# EAGLE design Audio_player_1_0 (EAGLE 6.6.0)
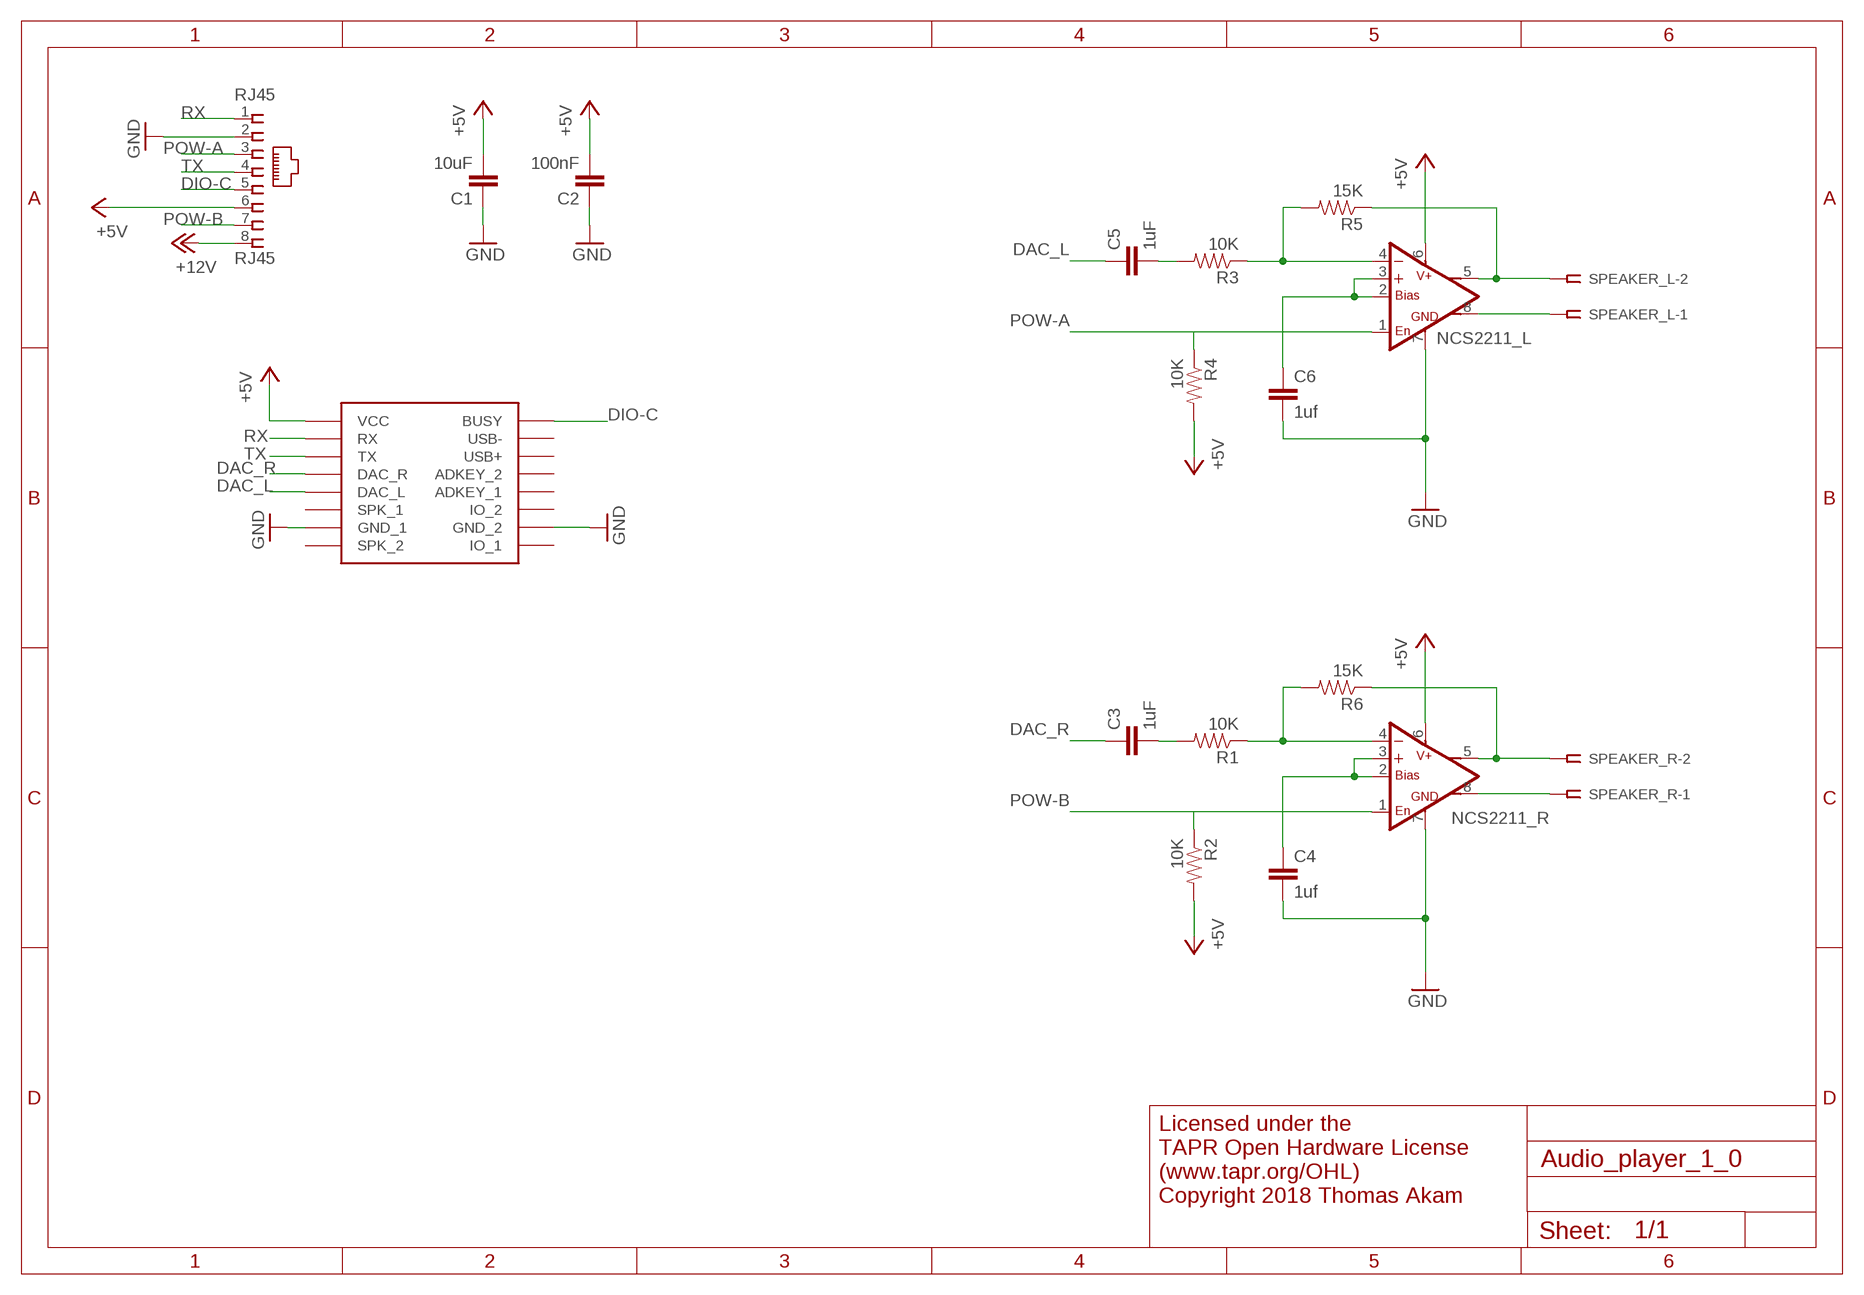
[diagram p0: schematic, sheet 1]

## Parts
C1  10uF  C-EUC0805  [C0805]
C2  100nF  C-EUC0805  [C0805]
C3  1uF  C-EUC0805  [C0805]
C4  1uf  C-EUC0805  [C0805]
C5  1uF  C-EUC0805  [C0805]
C6  1uf  C-EUC0805  [C0805]
NCS2211_L  NCS22111M  [SO08]
NCS2211_R  NCS22111M  [SO08]
R1  10K  0.3OHM-1/8W-1%(0805)  [0805]
R2  10K  0.3OHM-1/8W-1%(0805)  [0805]
R3  10K  0.3OHM-1/8W-1%(0805)  [0805]
R4  10K  0.3OHM-1/8W-1%(0805)  [0805]
R5  15K  0.3OHM-1/8W-1%(0805)  [0805]
R6  15K  0.3OHM-1/8W-1%(0805)  [0805]
RJ45  RJ45  RJ45VERTICAL  [RJ45-NO-SHIELD-VERTICAL]
SPEAKER_L  SSW-102-02-S-S-RA  [SSW-102-02-S-S-RA]
SPEAKER_R  SSW-102-02-S-S-RA  [SSW-102-02-S-S-RA]
U$1  DFPLAYER  [DFPLAYER]

## Nets
+5V: C1.2 C2.2 NCS2211_L.6(VS) NCS2211_R.6(VS) R2.2 R4.2 RJ45.6 U$1.VCC
+12V: RJ45.8
AMP_REF: C4.1 NCS2211_R.2(BIAS) NCS2211_R.3(+IN)
AMP_REF1: C6.1 NCS2211_L.2(BIAS) NCS2211_L.3(+IN)
DAC_L: C5.1 U$1.DAC_L
DAC_R: C3.1 U$1.DAC_R
DIO-C: RJ45.5 U$1.BUSY
GND: C1.1 C2.1 C4.2 C6.2 NCS2211_L.7(GND) NCS2211_R.7(GND) RJ45.2 U$1.GND_1 U$1.GND_2
N$1: NCS2211_L.8(-OUT) SPEAKER_L.1
N$2: NCS2211_R.8(-OUT) SPEAKER_R.1
N$3: C3.2 R1.2
N$4: C5.2 R3.2
POW-A: NCS2211_L.1(ENABLE) R4.1 RJ45.3
POW-B: NCS2211_R.1(ENABLE) R2.1 RJ45.7
RX: RJ45.1 U$1.RX
SIG1: NCS2211_L.4(-IN) R3.1 R5.2
SIG3: NCS2211_R.4(-IN) R1.1 R6.2
SPEAKER+: NCS2211_R.5(+OUT) R6.1 SPEAKER_R.2
SPEAKER+1: NCS2211_L.5(+OUT) R5.1 SPEAKER_L.2
TX: RJ45.4 U$1.TX
Unconnected: U$1.ADKEY1(ADKEY_1) U$1.ADKEY2(ADKEY_2) U$1.IO1(IO_1) U$1.IO2(IO_2) U$1.SPK1(SPK_1) U$1.SPK2(SPK_2) U$1.USB+ U$1.USB-

## Notes on the sheet
- Licensed under the
  TAPR Open Hardware License
  (www.tapr.org/OHL)
  Copyright 2018 Thomas Akam

## Library data of the parts
C1-C6 = rcl:C-EU: CAPACITOR, European symbol
NCS2211_L NCS2211_R = NCS2211:NCS2211: Low Voltage Audio Power Amplifier Source: http://cache.national.com/ds/LM/LM386.pdf
R1-R6 = SparkFun-Resistors:0.3OHM-1/8W-1%(0805): RES-11622; PROD_ID: RES-11622; VALUE: 0.3
RJ45 = con-tycoelectronics-vertical_RJ45:RJ45: CORCOM Modular RJ Jacks No Shield Source: www.tycoelectronics.com .. ENG_DS_1654001_1099_RJ_L_0507.pdf
SPEAKER_L SPEAKER_R = con-samtec:SSW-102-02-S-S: THROUGH-HOLE .025" SQ POST SOCKET Source: Samtec SSW.pdf; MPN: SSW-102-02-S-S-RA; OC_FARNELL: unknown; OC_NEWARK: 11P9352
U$1 = DFPlayer_v1:DFPLAYER

## Net classes
1 power: width 0.508 mm

## Board
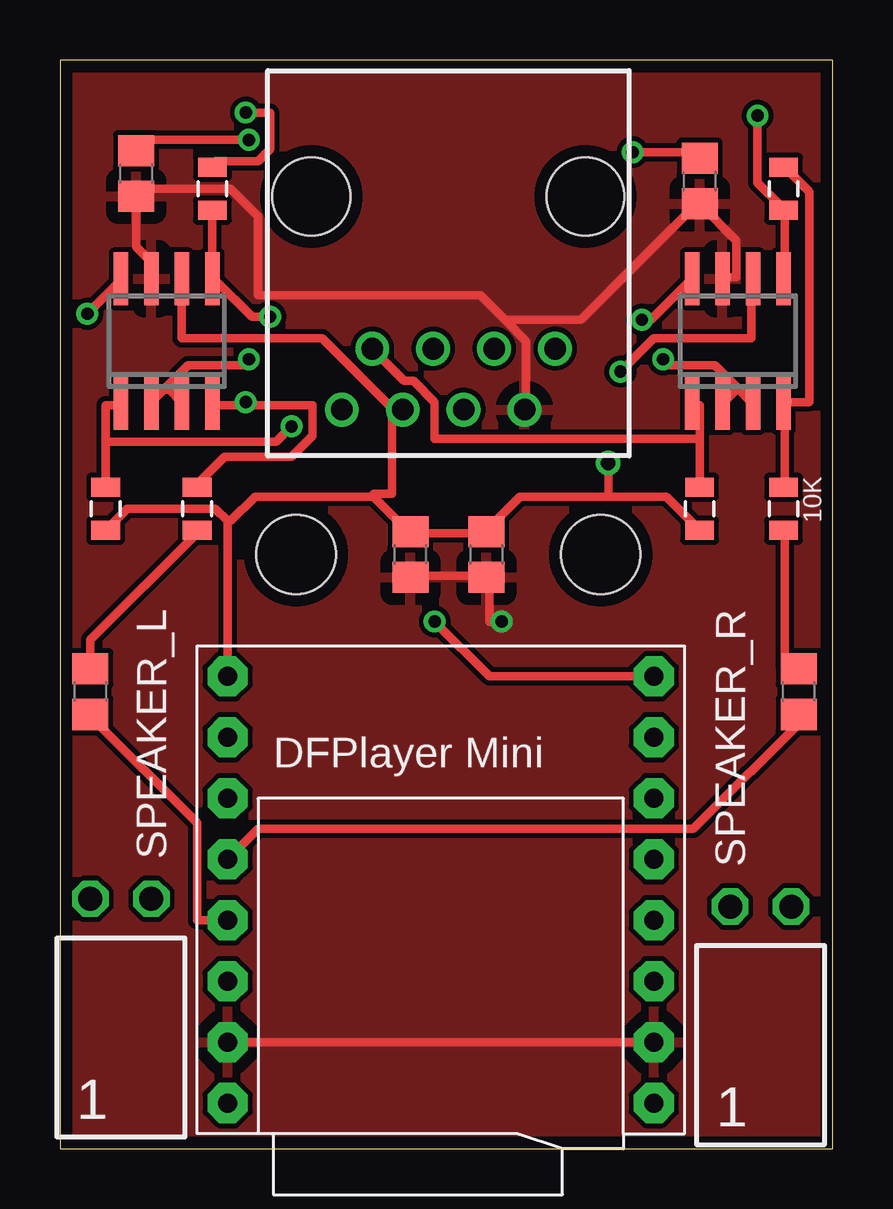
[diagram p1: board, top side]
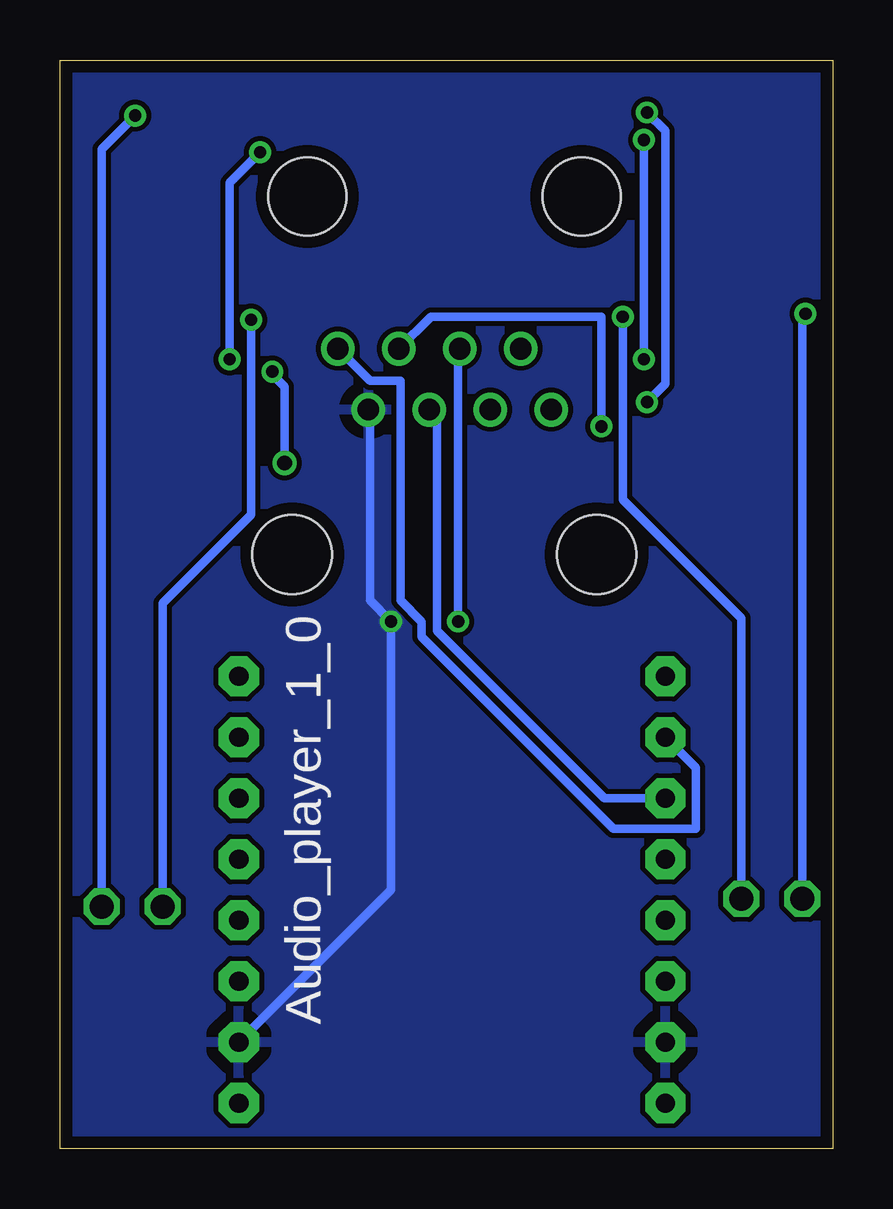
[diagram p2: board, bottom side, seen from below]

Size 32.22 x 45.37 mm. Coordinates in mm from the lower left corner, seen from the top.
Outline: 0,0 32.22,0 32.22,45.37 0,45.37 0,0
Copper layers (1*16): Top 0.035mm / dielectric 1.5mm / Bottom 0.035mm
Design rules "default *": minimum track width 14mil, minimum drill 20mil, track to track 8mil, track to pad 8mil, pad to pad 8mil, via to via 8mil, smd to smd 8mil, copper to edge 20mil, drill to drill 8mil, minimum pad ring 10mil, minimum via ring 8mil, stop-mask expansion 4mil, vias tented up to drill 0mil, thermal gap 20mil
Holes 3.3 mm at 22.54,24.77 9.84,24.77

### Footprints (pad centres in the part's own frame; a part is rotated, then mirrored left to right if it is on the bottom)
C0805 = smd 1.3 x 1.5: 1 -0.95,0; 2 0.95,0
SO08 = smd 0.6 x 2.2: 1 -1.905,-2.6; 2 -0.635,-2.6; 3 0.635,-2.6; 4 1.905,-2.6; 5 1.905,2.6; 6 0.635,2.6; 7 -0.635,2.6; 8 -1.905,2.6
0805 = smd 0.8 x 1.2: 1 -0.9,0; 2 0.9,0
RJ45-NO-SHIELD-VERTICAL = drill 0.9 pad 1.4: 1 -4.445,5.08; 2 -3.175,7.62; 3 -1.905,5.08; 4 -0.635,7.62; 5 0.635,5.08; 6 1.905,7.62; 7 3.175,5.08; 8 4.445,7.62 | hole 3.251: -5.715,-1.27; 5.715,-1.27
SSW-102-02-S-S-RA = drill 1 pad 1.5 octagon: 1 -1.27,1.524; 2 1.27,1.524
DFPLAYER = drill 0.8 pad 1.676 octagon: ADKEY1 8.89,-1.27; ADKEY2 8.89,1.27; BUSY 8.89,8.89; DAC_L -8.89,-1.27; DAC_R -8.89,1.27; GND_1 -8.89,-6.35; GND_2 8.89,-6.35; IO1 8.89,-8.89; IO2 8.89,-3.81; RX -8.89,6.35; SPK1 -8.89,-3.81; SPK2 -8.89,-8.89; TX -8.89,3.81; USB+ 8.89,3.81; USB- 8.89,6.35; VCC -8.89,8.89

### Placement (x,y rotation side)
C1  14.61,24.77 90 top
C2  17.78,24.77 90 top
C3  30.8,19.05 90 top
C4  26.67,40.32 270 top
C5  1.27,19.05 90 top
C6  3.17,40.64 270 top
NCS2211_L  4.45,33.66 0 top
NCS2211_R  28.26,33.66 0 top
R1  30.16,26.67 270 top
R2  26.67,26.67 270 top
R3  5.71,26.67 270 top
R4  1.91,26.67 270 top
R5  6.35,40.01 90 top
R6  30.16,40.01 90 top
RJ45  16.19,38.42 180 top
SPEAKER_L  2.54,8.89 0 top
SPEAKER_R  29.21,8.57 0 top
U$1  15.88,10.79 0 top

### Tracks (layer width: path | path; a pad name or v marks a point on that pad's centre or on a via)
+5V  (via drill 0.51, 0.61)
  Top 0.356: NCS2211_L.6 5.08,33.78 10.92,33.78 13.84,30.86 14.22,30.86 RJ45.6 13.84,30.73 13.84,27.3 13.08,27.3 13.08,27.18 | 6.99,26.16 6.48,26.67 2.79,26.67 R4.2 | U$1.VCC 6.99,26.16 | 22.86,27.18 19.18,27.18 17.78,25.78 C2.2 17.65,25.65 14.61,25.65 C1.2 14.48,25.78 13.08,27.18 | 22.86,27.18 23.37,27.18 25.27,27.18 R2.2 | v23.37,32.38 24.77,33.78 28.83,33.78 28.83,36.2 NCS2211_R.6 | 13.08,27.18 8.13,27.18 7.11,26.16 6.99,26.16 | v22.86,28.57 22.86,27.18
  Bottom 0.356: v23.37,32.38 23.37,32.26 22.86,31.75 v22.86,28.57
AMP_REF  (via drill 0.51)
  Top 0.356: v23.88,41.53 26.42,41.53 C4.1 | v25.15,32.89 25.4,32.64 27.3,32.64 28.26,31.69 | 28.26,31.69 28.83,31.11 NCS2211_R.3 | 28.26,31.69 27.69,31.11 NCS2211_R.2
  Bottom 0.356: v23.88,41.53 25.15,40.26 v25.15,32.89
AMP_REF1  (via drill 0.51)
  Top 0.356: v7.87,42.04 3.56,42.04 3.17,41.66 C6.1 | v7.87,32.89 7.62,32.64 5.33,32.64 4.38,31.69 | 4.38,31.69 3.81,31.11 NCS2211_L.2 | NCS2211_L.3 5.08,31.11 4.57,31.62 4.45,31.62 4.38,31.69
  Bottom 0.356: v7.87,32.89 v7.87,42.04
DAC_L
  Top 0.356: U$1.DAC_L 5.71,9.53 5.71,13.59 1.27,18.03 C5.1
DAC_R
  Top 0.356: U$1.DAC_R 8.26,13.34 26.42,13.34 31.11,18.03 C3.1
DIO-C  (via drill 0.51)
  Top 0.356: v15.62,21.97 17.91,19.68 U$1.BUSY
  Bottom 0.356: v15.62,21.97 15.62,33.27 RJ45.5
GND  (via drill 0.51)
  Top 0.356: U$1.GND_2 U$1.GND_1 | NCS2211_R.7 27.69,36.32 28.19,36.32 28.19,37.85 C4.2 26.54,39.37 21.72,34.54 18.67,34.54 18.61,34.48 | NCS2211_L.7 3.81,36.96 3.17,37.59 C6.2 3.3,39.75 3.56,40.01 7.11,40.01 8.26,38.86 8.26,35.56 17.53,35.56 18.61,34.48 | C1.1 14.61,23.88 17.78,23.88 C2.1 17.91,23.75 17.91,21.97 v18.41,21.97 | 18.61,34.48 19.43,33.66 19.43,30.86 RJ45.2
  Bottom 0.356: RJ45.2 19.3,30.73 19.3,22.86 v18.41,21.97 18.41,10.79 U$1.GND_2
  pour Bottom: 32.38,0 32.38,45.72 0,45.72 0,0
  pour Top: 0,0 0,45.72 32.38,45.72 32.38,0
N$1  (via drill 0.51)
  Top 0.356: v1.14,34.8 2.54,36.2 NCS2211_L.8
  Bottom 0.356: v1.14,34.8 1.27,34.67 SPEAKER_L.1
N$2  (via drill 0.51)
  Top 0.356: v24.26,34.54 24.64,34.54 26.29,36.2 NCS2211_R.8
  Bottom 0.356: v24.26,34.54 24.26,26.42 27.94,22.73 SPEAKER_R.1
N$3
  Top 0.356: R1.2 30.23,25.65 30.23,20.07 31.11,20.07 C3.2
N$4
  Top 0.356: C5.2 1.27,21.21 5.71,25.65 R3.2
POW-A  (via drill 0.51)
  Top 0.356: 1.91,29.46 1.91,30.99 2.54,30.99 NCS2211_L.1 | 1.91,29.46 R4.1 | v9.65,30.1 9.02,29.46 1.91,29.46
  Bottom 0.356: RJ45.3 16.76,34.67 9.65,34.67 v9.65,30.1
POW-B
  Top 0.356: 26.67,29.59 26.67,30.99 26.42,30.99 NCS2211_R.1 | 26.67,29.59 R2.1 | RJ45.7 14.35,32 14.73,32 15.62,31.11 15.62,29.59 26.67,29.59
RX
  Bottom 0.356: RJ45.1 19.3,32 18.03,32 18.03,22.86 17.14,21.97 17.14,21.34 9.14,13.34 5.71,13.34 5.71,15.88 U$1.RX
SIG1  (via drill 0.51)
  Top 0.356: 7.75,30.99 6.35,30.99 NCS2211_L.4 | 7.75,30.99 10.54,30.99 10.54,29.72 9.65,28.83 6.86,28.83 5.71,27.69 R3.1 | v7.75,43.18 8.76,43.18 8.76,41.66 8.26,41.15 6.48,41.15 6.35,41.02 R5.2 | v7.75,31.11 7.75,30.99
  Bottom 0.356: v7.75,43.18 6.99,42.42 6.99,31.88 v7.75,31.11
SIG3
  Top 0.356: R1.1 30.23,27.69 30.23,30.99 NCS2211_R.4 30.23,31.11 31.24,31.11 31.24,39.88 30.23,40.89 R6.2
SPEAKER+  (via drill 0.51)
  Top 0.356: NCS2211_R.5 30.23,36.32 30.23,38.99 R6.1 30.1,39.24 29.08,40.26 v29.08,43.05
  Bottom 0.356: v29.08,43.05 30.48,41.66 SPEAKER_R.2
SPEAKER+1  (via drill 0.51)
  Top 0.356: R5.1 NCS2211_L.5 6.48,36.2 8,34.67 v8.76,34.67
  Bottom 0.356: v8.76,34.67 8.76,27.05 3.81,22.1 SPEAKER_L.2
TX
  Bottom 0.356: RJ45.4 16.51,30.48 16.51,21.59 9.53,14.61 U$1.TX

### Text on the board
bPlace: Audio_player_1_0
Document: Licensed under the TAPR Open Hardware License / (www.tapr.org/OHL) / Copyright 2018 Thomas Akam